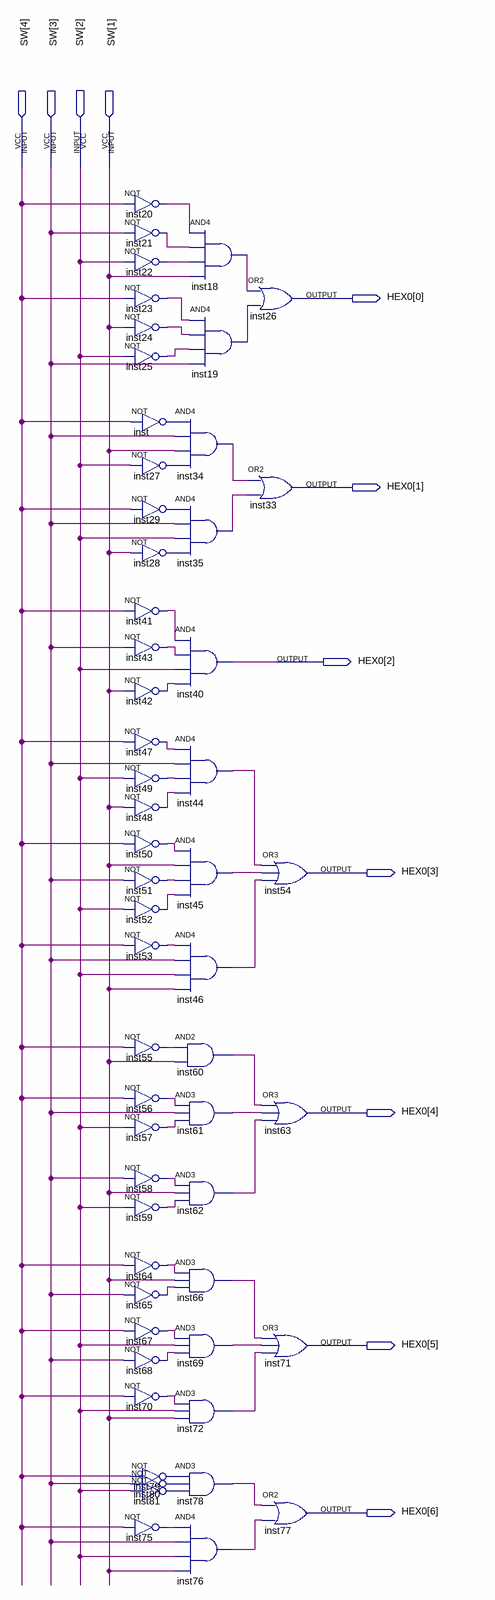
[diagram p0: schematic sheet]
// Quartus schematic Etapa1.bdf as structural Verilog: 56 symbols, 11 pins
module Etapa1 (
  input  [4:1] SW,
  output [6:0] HEX0
);

  wire inst18_out, inst19_out, inst20_out, inst21_out, inst22_out, inst23_out, inst24_out, inst25_out,
       inst27_out, inst28_out, inst29_out, inst34_out, inst35_out, inst41_out, inst42_out, inst43_out,
       inst44_out, inst45_out, inst46_out, inst47_out, inst48_out, inst49_out, inst50_out, inst51_out,
       inst52_out, inst53_out, inst55_out, inst56_out, inst57_out, inst58_out, inst59_out, inst60_out,
       inst61_out, inst62_out, inst64_out, inst65_out, inst66_out, inst67_out, inst68_out, inst69_out,
       inst70_out, inst72_out, inst75_out, inst76_out, inst78_out, inst79_out, inst80_out, inst81_out,
       inst_out;

  not inst20 (inst20_out, SW[4]);
  not inst21 (inst21_out, SW[3]);
  not inst22 (inst22_out, SW[2]);
  not inst23 (inst23_out, SW[4]);
  not inst24 (inst24_out, SW[1]);
  not inst25 (inst25_out, SW[2]);
  not inst (inst_out, SW[4]);
  not inst27 (inst27_out, SW[2]);
  not inst29 (inst29_out, SW[4]);
  not inst28 (inst28_out, SW[1]);
  not inst41 (inst41_out, SW[4]);
  not inst43 (inst43_out, SW[3]);
  not inst42 (inst42_out, SW[1]);
  not inst47 (inst47_out, SW[4]);
  not inst49 (inst49_out, SW[2]);
  not inst48 (inst48_out, SW[1]);
  not inst50 (inst50_out, SW[4]);
  not inst51 (inst51_out, SW[3]);
  not inst52 (inst52_out, SW[2]);
  not inst53 (inst53_out, SW[4]);
  not inst55 (inst55_out, SW[4]);
  not inst56 (inst56_out, SW[4]);
  not inst57 (inst57_out, SW[2]);
  not inst58 (inst58_out, SW[3]);
  not inst59 (inst59_out, SW[2]);
  not inst64 (inst64_out, SW[4]);
  not inst65 (inst65_out, SW[3]);
  not inst67 (inst67_out, SW[4]);
  not inst68 (inst68_out, SW[3]);
  not inst70 (inst70_out, SW[4]);
  not inst79 (inst79_out, SW[4]);
  not inst80 (inst80_out, SW[3]);
  not inst81 (inst81_out, SW[2]);
  not inst75 (inst75_out, SW[4]);
  and inst18 (inst18_out, inst20_out, inst21_out, inst22_out, SW[1]);
  and inst19 (inst19_out, inst23_out, inst24_out, inst25_out, SW[3]);
  and inst34 (inst34_out, inst_out, SW[3], SW[1], inst27_out);
  and inst35 (inst35_out, inst29_out, SW[3], SW[2], inst28_out);
  and inst40 (HEX0[2], inst41_out, inst43_out, SW[2], inst42_out);
  and inst44 (inst44_out, inst47_out, SW[3], inst49_out, inst48_out);
  and inst45 (inst45_out, inst50_out, SW[1], inst51_out, inst52_out);
  and inst46 (inst46_out, inst53_out, SW[3], SW[2], SW[1]);
  and inst60 (inst60_out, inst55_out, SW[1]);
  and inst61 (inst61_out, inst56_out, SW[3], inst57_out);
  and inst62 (inst62_out, inst58_out, SW[1], inst59_out);
  and inst66 (inst66_out, inst64_out, SW[1], inst65_out);
  and inst69 (inst69_out, inst67_out, SW[2], inst68_out);
  and inst72 (inst72_out, inst70_out, SW[2], SW[1]);
  and inst78 (inst78_out, inst79_out, inst80_out, inst81_out);
  and inst76 (inst76_out, inst75_out, SW[3], SW[2], SW[1]);
  or inst26 (HEX0[0], inst18_out, inst19_out);
  or inst33 (HEX0[1], inst34_out, inst35_out);
  or inst54 (HEX0[3], inst44_out, inst45_out, inst46_out);
  or inst63 (HEX0[4], inst60_out, inst61_out, inst62_out);
  or inst71 (HEX0[5], inst66_out, inst69_out, inst72_out);
  or inst77 (HEX0[6], inst78_out, inst76_out);
endmodule
